# Altium schematic sheet Airspeed2_B3.SchDoc
size A3; SheetNumber: 2; SheetTotal: 3
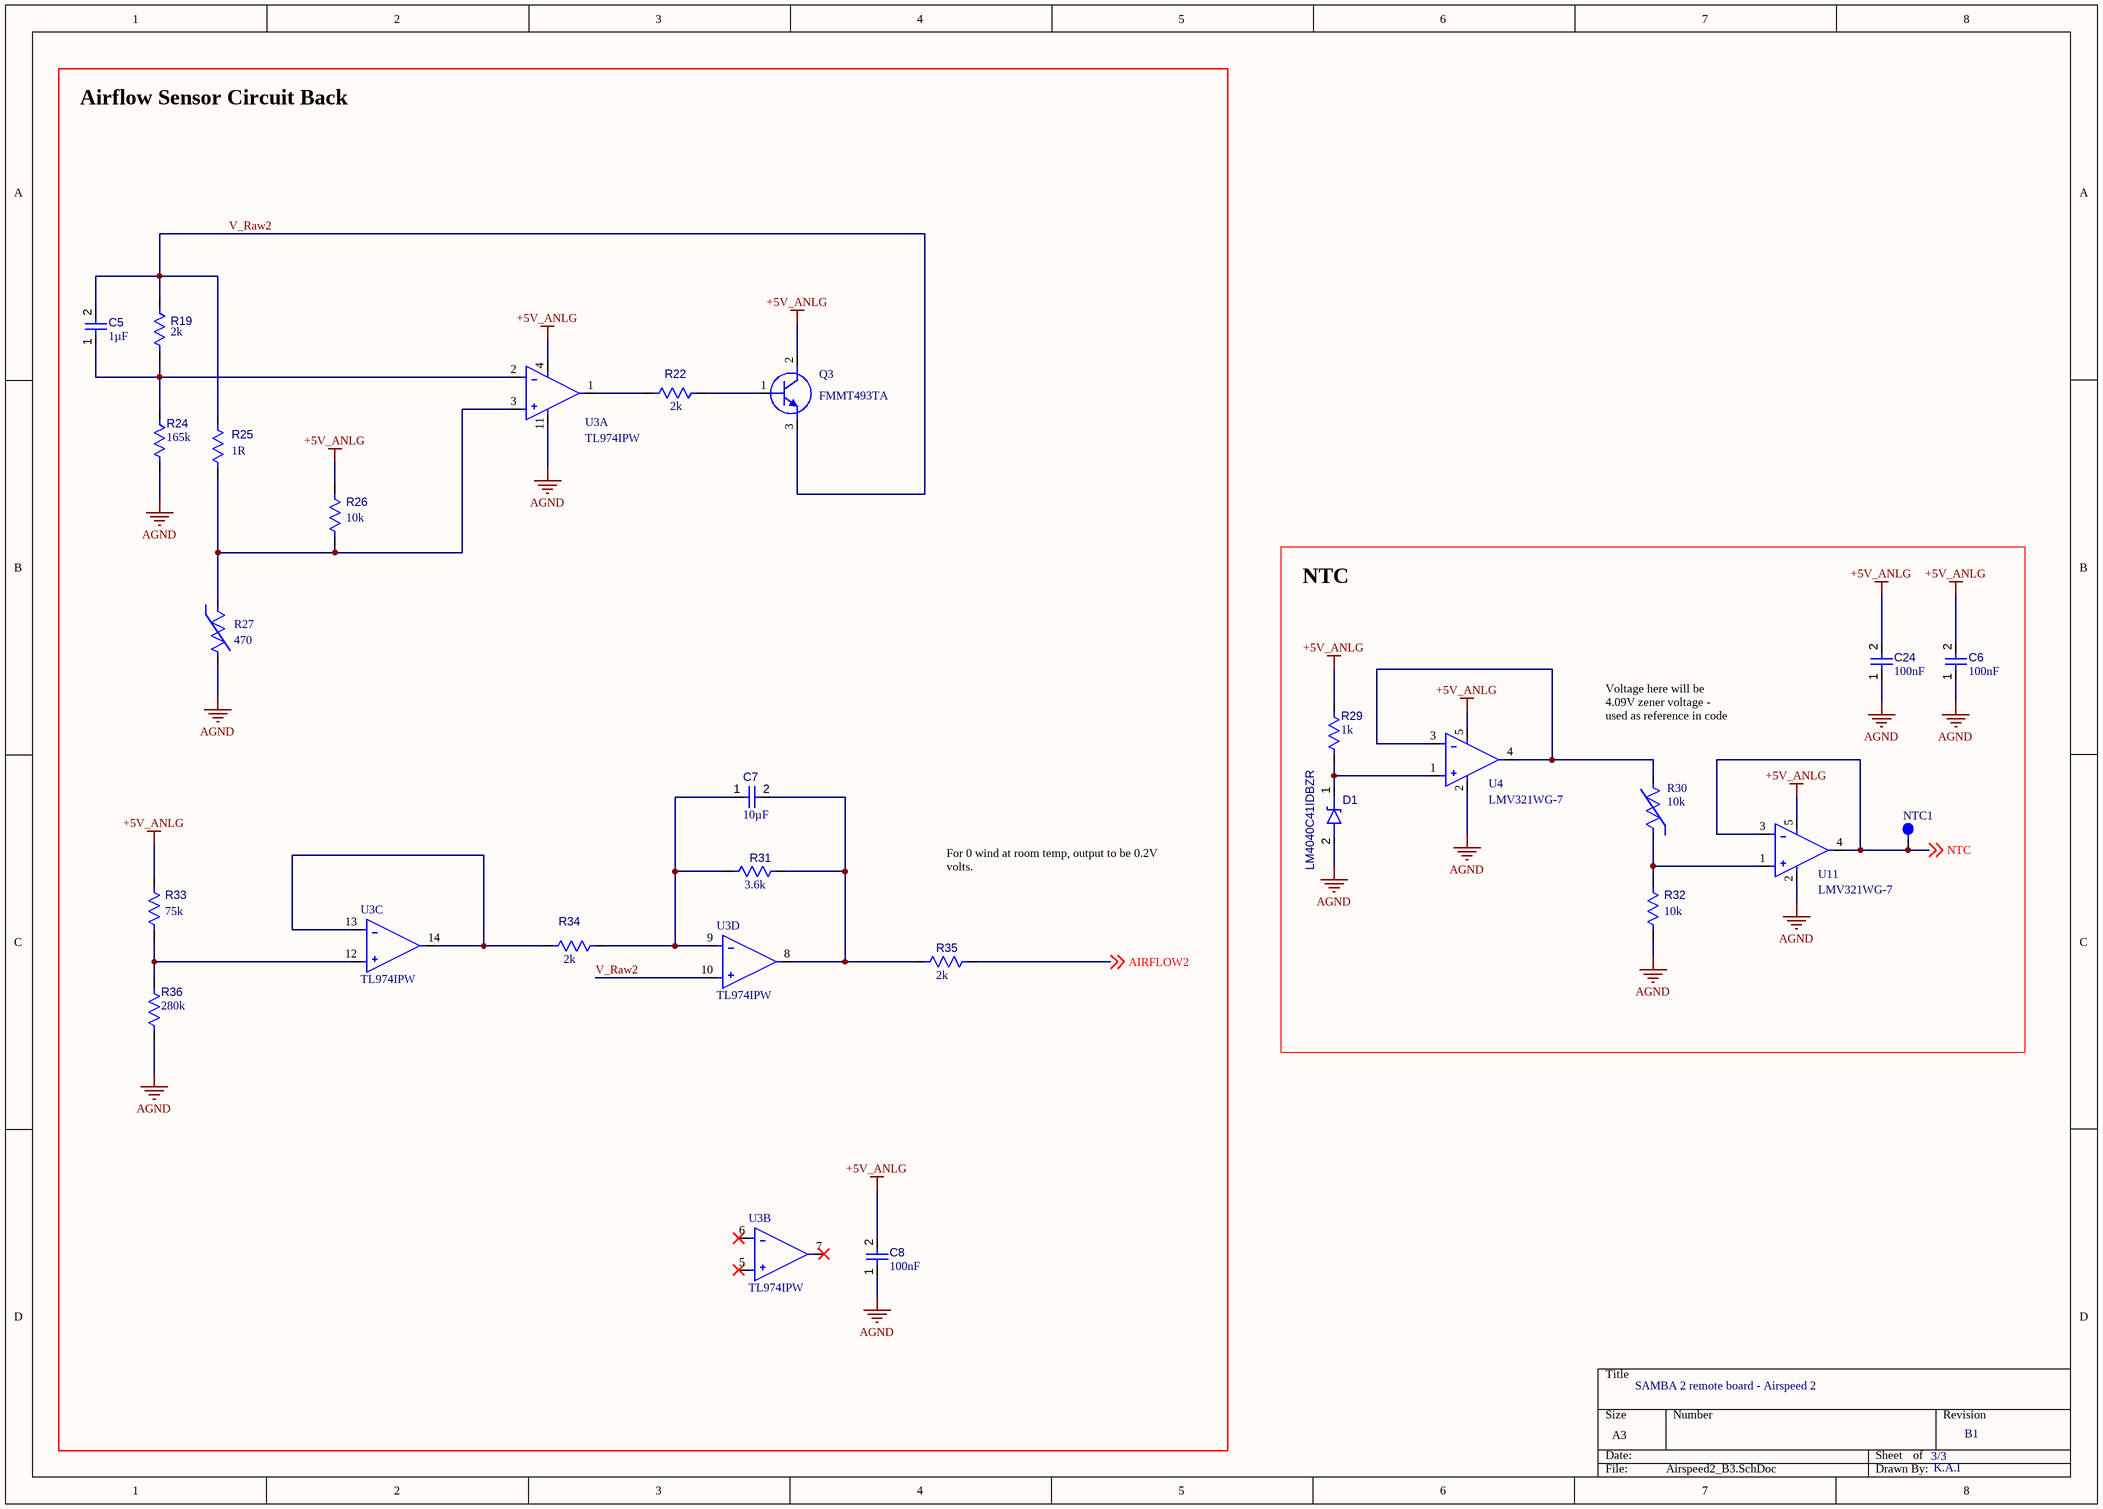
[diagram p0: Airspeed2_B3.SchDoc]

## Parts
C5  value 1µF  [MANUF_CAP_0603]  (hidden comment: CL10B105KA8NFNC)
C6  value 100nF  [MANUF_CAP_0603]  (hidden comment: CC0603KRX7R7BB104)
C7  value 10µF  [FP-GRM188-0_15-MFG]  (hidden comment: GRM188R61A106ME69D)
C8  value 100nF  [MANUF_CAP_0603]  (hidden comment: CC0603KRX7R7BB104)
C24  value 100nF  [MANUF_CAP_0603]  (hidden comment: CC0603KRX7R7BB104)
D1  LM4040C41IDBZR  [DBZ0003A_M]
NTC1  PH1-01-UA  [FP-PH1-01-UA-MFG]  (value not drawn)  (no BOM)
Q3  FMMT493TA  [SOT95P237X110-3N]
R19  value 2k  [MANUF_RES_0603]  (hidden comment: ERJ-3EKF2001V)
R22  value 2k  [MANUF_RES_0603]  (hidden comment: ERJ-3EKF2001V)
R24  value 165k  [RESC1608X55X30NL15T15]  (hidden comment: ERJ-3EKF1653V)
R25  value 1R  [Vishay_CRCW0805-HPe3_MFG]  (hidden comment: CRCW08051R00FKEAHP)
R26  value 10k  [MANUF_RES_0603]  (hidden comment: RC0603FR-0710KL)
R27  value 470  [NTCG103NH471JT1-Footprint-1]  (hidden comment: NTCG103NH471JT1)
R29  value 1k  [RESC1608X55X25ML10T15]  (hidden comment: Resistor 1k +/-1% 0603 100 mW)
R30  value 10k  [TT7-10KC3-11-Footprint-1]  (hidden comment: TT7-10KC3-11)
R31  value 3.6k  [RESC1609X50X30NL08T20]  (hidden comment: CRCW06033K60FKEAC)
R32  value 10k  [MANUF_RES_0603]  (hidden comment: RC0603FR-0710KL)
R33  value 75k  [IPC B 0603 RES]  (hidden comment: AC0603FR-0775KL)
R34  value 2k  [MANUF_RES_0603]  (hidden comment: ERJ-3EKF2001V)
R35  value 2k  [MANUF_RES_0603]  (hidden comment: ERJ-3EKF2001V)
R36  value 280k  [IPC B 0603 RES]  (hidden comment: RC0603FR-07280KL)
U3  TL974IPW  [TSOP65P640X120-14N]  (parts A,B,C,D of 4)
U4  LMV321WG-7  [SOT95P285X130-5N]
U11  LMV321WG-7  [SOT95P285X130-5N]

## Blocks framed on the sheet
Airflow Sensor Circuit Back: C5 C7 C8 Q3 R19 R22 R24-R27 R31 R33-R36 U3
NTC: C6 C24 D1 NTC1 R29 R30 R32 U4 U11

## Nets
+5V_ANLG: C6.2 C8.2 C24.2 Q3.2(C) R26.2 R29.2 R33.2 U3.4(VDD) U4.5(VDD) U11.5(VDD)
AGND: C6.1 C8.1 C24.1 D1.2(A) R24.1 R27.2 R32.1 R36.1 U3.11(VSS) U4.2(VSS) U11.2(VSS)
AIRFLOW2: R35.1 ; off-sheet AIRFLOW2
NTC: NTC1.1 U11.3(-IN) U11.4(OUT) ; off-sheet NTC
V_Raw2: C5.2 Q3.3(E) R19.2 R25.2 U3.10(+IN_C)
NetC5_1: C5.1 R19.1 R24.2 U3.2(-IN_A)
NetC7_1: C7.1 R31.1 R34.1 U3.9(-IN_C)
NetC7_2: C7.2 R31.2 R35.2 U3.8(OUT_C)
NetD1_1: D1.1(K) R29.1 U4.1(+IN)
NetQ3_1: Q3.1(B) R22.1
NetR22_2: R22.2 U3.1(OUT_A)
NetR25_1: R25.1 R26.1 R27.1 U3.3(+IN_A)
NetR30_1: R30.1 R32.2 U11.1(+IN)
NetR30_2: R30.2 U4.3(-IN) U4.4(OUT)
NetR33_1: R33.1 R36.2 U3.12(+IN_D)
NetR34_2: R34.2 U3.13(-IN_D) U3.14(OUT_D)

Not connected (* = marked no-connect by the designer): U3 5(+IN_B)* 6(-IN_B)* 7(OUT_B)*

## Notes on the sheet
- (near R30) Voltage here will be 4.09V zener voltage - used as reference in code
- For 0 wind at room temp, output to be 0.2V volts.
- SAMBA 2 remote board - Airspeed 2
- 3/3
- B1
- K.A.I

## Library data of the parts
C5 = CMP-001-00098-2: Ceramic Capacitor, Multilayer, Ceramic, 25V, 10% +Tol, 10% -Tol, X7R, 15% TC, 1uF, Surface Mount, 0603; Pins: 2; Mounting Technology: Surface Mount; Min Operating Temperature: -55°C; Case/Package: 0603; Capacitor Type: Ceramic; RoHS Compliant: Yes; Max Operating Temperature: 125°C
C6 C8 C24 = CMP-001-00099-4: Ceramic Capacitor, Multilayer, Ceramic, 16V, 10% +Tol, 10% -Tol, X7R, 15% TC, 0.1uF, Surface Mount, 0603; Pins: 2; Min Operating Temperature: -55°C; Max Operating Temperature: 125°C; Case/Package: 0603; RoHS Compliant: Yes; Mounting Technology: Surface Mount; Capacitor Type: Ceramic
C7 = CMP-001-00097-1: Ceramic Capacitor, Multilayer, Ceramic, 10V, 20% +Tol, 20% -Tol, X5R, 15% TC, 10uF, Surface Mount, 0603; Min Operating Temperature: -55°C; RoHS Compliant: Yes; Pins: 2; Capacitor Type: Ceramic; Max Operating Temperature: 85°C; Mounting Technology: Surface Mount; Case/Package: 0603
D1 = CMP-004-00033-2: Two Terminal Voltage Reference, 1 Output, 4.096V, BIPolar, PDSO3; Pins: 3; Case/Package: TSSOP; Max Operating Temperature: 85°C; Min Operating Temperature: -40°C; RoHS Compliant: Yes
NTC1 = CMP-002-00083-1: Conn Unshrouded Header HDR 1 POS 2.54mm Solder ST Thru-Hole Bag
Q3 = CMP-013-00034-1: Small Signal Bipolar Transistor, 1A I(C), 100V V(BR)CEO, 1-Element, NPN, Silicon; Frequency: 150MHz; Max Operating Temperature: 150°C; RoHS Compliant: Yes; Pins: 3
R19 R22 R34 R35 = CMP-009-00207-2: Fixed Resistor, Metal Glaze/thick Film, 0.1W, 2000ohm, 75V, 1% +/-Tol, 100ppm/Cel, Surface Mount, 0603; Power: 100mW; RoHS Compliant: Yes; Pins: 2; Max Operating Temperature: 155°C; Case/Package: 0603; Tolerance: 1%; Mounting Technology: Surface Mount; Min Operating Temperature: -55°C
R24 = CMP-009-00209-1: Fixed Resistor, Metal Glaze/thick Film, 0.1W, 165000ohm, 75V, 1% +/-Tol, 100ppm/Cel, Surface Mount, 0603; Power: 100mW; Pins: 2; RoHS Compliant: Yes; Mounting Technology: Surface Mount; Min Operating Temperature: -55°C; Max Operating Temperature: 155°C; Case/Package: 0603; Tolerance: 1%
R25 = CMP-009-00205-1: Fixed Resistor, Metal Glaze/thick Film, 0.5W, 1ohm, 150V, 1% +/-Tol, 100ppm/Cel, Surface Mount, 0805; Power: 500mW; Pins: 2; Max Operating Temperature: 155°C; Mounting Technology: Surface Mount; RoHS Compliant: Yes; Min Operating Temperature: -55°C; Case/Package: 0805; Tolerance: 1%
R26 R32 = CMP-009-00204-2: Fixed Resistor, Metal Glaze/thick Film, 0.1W, 10000ohm, 75V, 1% +/-Tol, 100ppm/Cel, Surface Mount, 0603; Power: 100mW; Pins: 2; Max Operating Temperature: 155°C; Case/Package: 0603; RoHS Compliant: Yes; Tolerance: 1%; Min Operating Temperature: -55°C; Mounting Technology: Surface Mount
R27 = CMP-009-00192-3: NTC Thermistor, 470ohm, Surface Mount; Tolerance: 5%; Power: 100mW; RoHS Compliant: Yes; Pins: 2; Min Operating Temperature: -40°C; Max Operating Temperature: 125°C; Mounting Technology: Surface Mount
R29 = CMP-009-00014-6: Chip Resistor, 1 KOhm, +/-1%, 0.1 W, -55 to 155 degC, 0603 (1608 Metric); Tolerance: 1%; Power: 100mW; Voltage Rating: 50V; Pins: 2; Min Operating Temperature: -55°C; Mounting Technology: SM; Max Operating Temperature: 155°C; Case/Package: 0603; RoHS Compliant: True
R30 = CMP-009-00210-1: Lead Frame Ntc 10K 1 Ohm B TT7 3977K; Tolerance: 1%; Case/Package: Through hole
R31 = CMP-009-00200-1: Fixed Resistor, Metal Glaze/thick Film, 0.1W, 3600ohm, 75V, 1% +/-Tol, 100ppm/Cel, Surface Mount, 0603; Power: 100mW; Case/Package: 0603; Min Operating Temperature: -55°C; RoHS Compliant: Yes; Pins: 2; Tolerance: 1%; Max Operating Temperature: 155°C
R33 = CMP-009-00208-1: Fixed Resistor, Metal Glaze/thick Film, 0.1W, 75000ohm, 75V, 1% +/-Tol, 100ppm/Cel, Surface Mount, 0603; Power: 100mW; Max Operating Temperature: 155°C; Tolerance: 1%; Min Operating Temperature: -55°C; Case/Package: 0603; Mounting Technology: Surface Mount; RoHS Compliant: Yes; Pins: 2
R36 = CMP-009-00212-1: Fixed Resistor, Metal Glaze/thick Film, 0.1W, 280000ohm, 75V, 1% +/-Tol, 100ppm/Cel, Surface Mount, 0603; Power: 100mW; Max Operating Temperature: 155°C; Tolerance: 1%; Pins: 2; Case/Package: 0603; Mounting Technology: Surface Mount; RoHS Compliant: Yes; Min Operating Temperature: -55°C
U3 = CMP-014-00004-4: Operational Amplifier, 4 Func, 6000uV Offset-Max, BIPolar, PDSO14; Nominal Supply Voltage: 2.5V; Channels: 4; Max Operating Temperature: 125°C; RoHS Compliant: Yes; Pins: 14; Case/Package: TSSOP; Min Operating Temperature: -40°C
U4 U11 = CMP-014-00005-1: Operational Amplifier, 1 Func, 9000uV Offset-Max, CMOS, PDSO5; Channels: 1; Nominal Supply Voltage: 2.7V; Min Operating Temperature: -40°C; Pins: 5; Max Operating Temperature: 85°C; Case/Package: LSSOP; RoHS Compliant: Yes